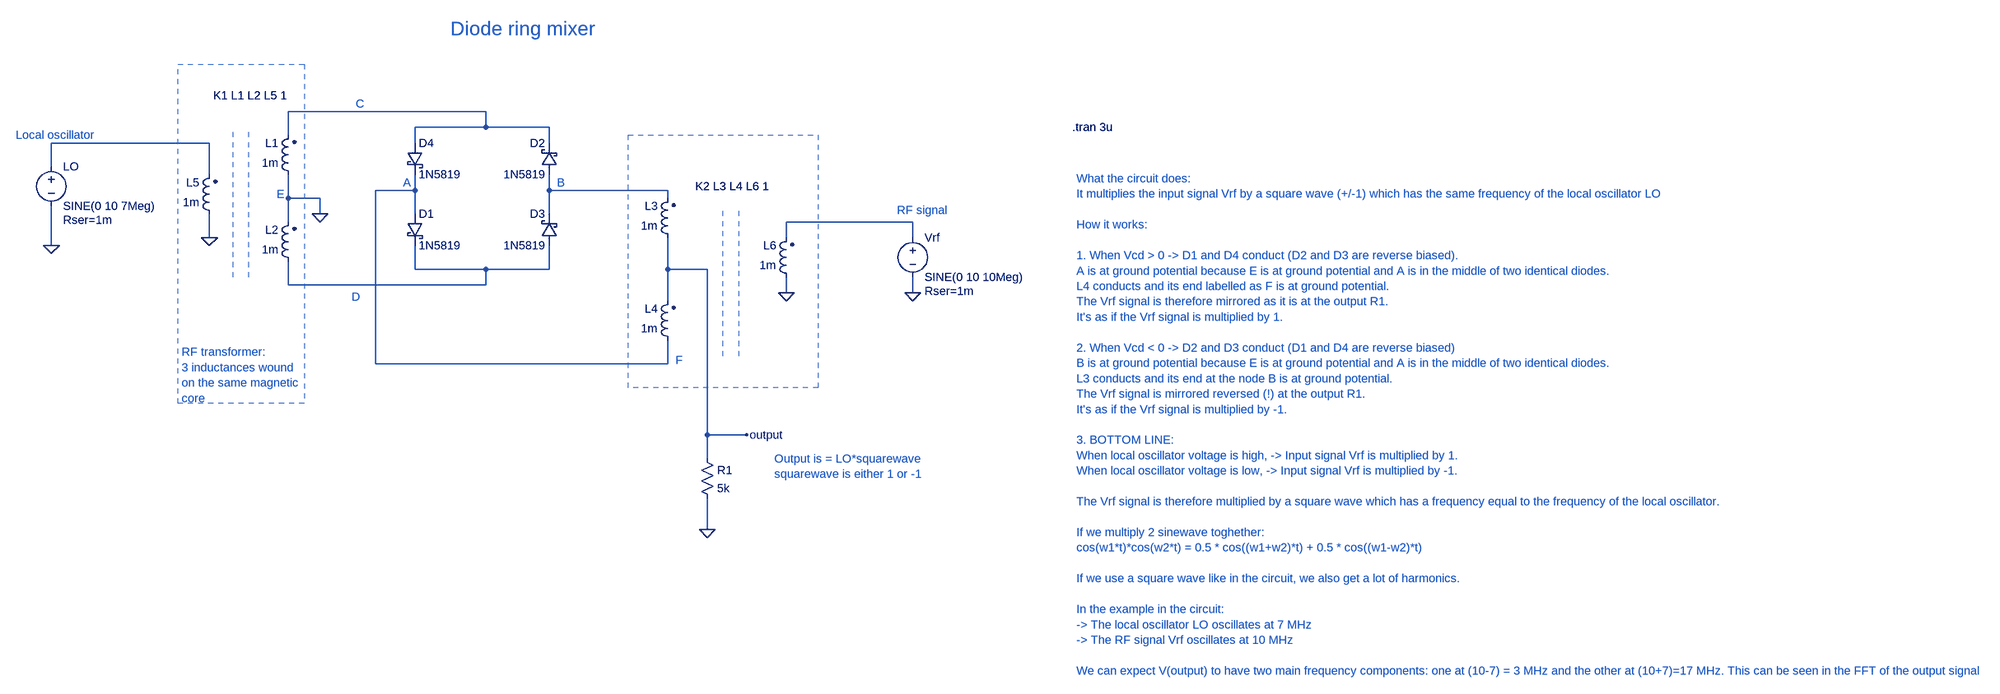
[diagram p0: schematic diode-ring-mixer.asc]
diode-ring-mixer.asc, the LTspice schematic file:
Version 4
SHEET 1 3404 1536
WIRE 272 0 -128 0
WIRE 272 32 272 0
WIRE 272 32 128 32
WIRE 400 32 272 32
WIRE -128 48 -128 0
WIRE -288 64 -608 64
WIRE 128 64 128 32
WIRE 400 64 400 32
WIRE -608 112 -608 64
WIRE -288 128 -288 64
WIRE 128 160 128 128
WIRE 128 160 48 160
WIRE 400 160 400 128
WIRE 640 160 400 160
WIRE -128 176 -128 128
WIRE -64 176 -128 176
WIRE 640 176 640 160
WIRE -64 208 -64 176
WIRE 128 208 128 160
WIRE 400 208 400 160
WIRE -128 224 -128 176
WIRE 1136 224 880 224
WIRE -288 256 -288 208
WIRE 880 256 880 224
WIRE 1136 256 1136 224
WIRE -608 272 -608 192
WIRE 128 320 128 272
WIRE 272 320 128 320
WIRE 400 320 400 272
WIRE 400 320 272 320
WIRE 640 320 640 256
WIRE 720 320 640 320
WIRE -128 352 -128 304
WIRE 272 352 272 320
WIRE 272 352 -128 352
WIRE 880 368 880 336
WIRE 1136 368 1136 336
WIRE 640 384 640 320
WIRE 48 512 48 160
WIRE 640 512 640 464
WIRE 640 512 48 512
WIRE 720 656 720 320
WIRE 800 656 720 656
WIRE 720 704 720 656
WIRE 720 848 720 784
FLAG 880 368 0
FLAG -64 208 0
FLAG -288 256 0
FLAG 1136 368 0
FLAG -608 272 0
FLAG 720 848 0
FLAG 800 656 output
SYMBOL ind2 -112 144 R180
WINDOW 0 36 80 Left 2
WINDOW 3 36 40 Left 2
SYMATTR InstName L1
SYMATTR Value 1m
SYMATTR Type ind
SYMBOL ind2 -112 320 R180
WINDOW 0 36 80 Left 2
WINDOW 3 36 40 Left 2
SYMATTR InstName L2
SYMATTR Value 1m
SYMATTR Type ind
SYMBOL ind2 656 272 R180
WINDOW 0 36 80 Left 2
WINDOW 3 36 40 Left 2
SYMATTR InstName L3
SYMATTR Value 1m
SYMATTR Type ind
SYMBOL ind2 656 480 R180
WINDOW 0 36 80 Left 2
WINDOW 3 36 40 Left 2
SYMATTR InstName L4
SYMATTR Value 1m
SYMATTR Type ind
SYMBOL ind2 -272 224 R180
WINDOW 0 36 80 Left 2
WINDOW 3 36 40 Left 2
SYMATTR InstName L5
SYMATTR Value 1m
SYMATTR Type ind
SYMBOL ind2 896 352 R180
WINDOW 0 36 80 Left 2
WINDOW 3 36 40 Left 2
SYMATTR InstName L6
SYMATTR Value 1m
SYMATTR Type ind
SYMBOL voltage -608 96 R0
WINDOW 123 0 0 Left 0
WINDOW 39 24 124 Left 2
SYMATTR SpiceLine Rser=1m
SYMATTR InstName LO
SYMATTR Value SINE(0 10 7Meg)
SYMBOL voltage 1136 240 R0
WINDOW 123 0 0 Left 0
WINDOW 39 24 124 Left 2
SYMATTR SpiceLine Rser=1m
SYMATTR InstName Vrf
SYMATTR Value SINE(0 10 10Meg)
SYMBOL res 704 688 R0
SYMATTR InstName R1
SYMATTR Value 5k
SYMBOL schottky 416 128 R180
WINDOW 0 24 64 Left 2
WINDOW 3 24 0 Left 2
SYMATTR InstName D2
SYMATTR Value 1N5819
SYMATTR Description Diode
SYMATTR Type diode
SYMBOL schottky 416 272 R180
WINDOW 0 24 64 Left 2
WINDOW 3 24 0 Left 2
SYMATTR InstName D3
SYMATTR Value 1N5819
SYMATTR Description Diode
SYMATTR Type diode
SYMBOL schottky 112 208 R0
SYMATTR InstName D1
SYMATTR Value 1N5819
SYMATTR Description Diode
SYMATTR Type diode
SYMBOL schottky 112 64 R0
SYMATTR InstName D4
SYMATTR Value 1N5819
SYMATTR Description Diode
SYMATTR Type diode
TEXT -280 -32 Left 2 !K1 L1 L2 L5 1
TEXT 696 152 Left 2 !K2 L3 L4 L6 1
TEXT 1496 32 Left 2 !.tran 3u
TEXT -680 48 Left 2 ;Local oscillator
TEXT 1104 200 Left 2 ;RF signal
TEXT 104 144 Left 2 ;A
TEXT 416 144 Left 2 ;B
TEXT 200 -168 Left 4 ;Diode ring mixer
TEXT 8 -16 Left 2 ;C
TEXT 0 376 Left 2 ;D
TEXT 1504 136 Left 2 ;What the circuit does:\nIt multiplies the input signal Vrf by a square wave (+/-1) which has the same frequency of the local oscillator LO\n \nHow it works:\n \n1. When Vcd > 0 -> D1 and D4 conduct (D2 and D3 are reverse biased).\nA is at ground potential because E is at ground potential and A is in the middle of two identical diodes.\nL4 conducts and its end labelled as F is at ground potential.\nThe Vrf signal is therefore mirrored as it is at the output R1.\nIt's as if the Vrf signal is multiplied by 1.\n \n2. When Vcd < 0 -> D2 and D3 conduct (D1 and D4 are reverse biased)\nB is at ground potential because E is at ground potential and A is in the middle of two identical diodes.\nL3 conducts and its end at the node B is at ground potential.\nThe Vrf signal is mirrored reversed (!) at the output R1.\nIt's as if the Vrf signal is multiplied by -1.\n \n3. BOTTOM LINE:\nWhen local oscillator voltage is high, -> Input signal Vrf is multiplied by 1.\nWhen local oscillator voltage is low, -> Input signal Vrf is multiplied by -1.\n \nThe Vrf signal is therefore multiplied by a square wave which has a frequency equal to the frequency of the local oscillator.\n \nIf we multiply 2 sinewave toghether:\ncos(w1*t)*cos(w2*t) = 0.5 * cos((w1+w2)*t) + 0.5 * cos((w1-w2)*t)\n \nIf we use a square wave like in the circuit, we also get a lot of harmonics.\n \nIn the example in the circuit:\n-> The local oscillator LO oscillates at 7 MHz\n-> The RF signal Vrf oscillates at 10 MHz\n \nWe can expect V(output) to have two main frequency components: one at (10-7) = 3 MHz and the other at (10+7)=17 MHz. This can be seen in the FFT of the output signal
TEXT -344 488 Left 2 ;RF transformer:\n3 inductances wound\non the same magnetic\ncore
TEXT -152 168 Left 2 ;E
TEXT 656 504 Left 2 ;F
TEXT 856 704 Left 2 ;Output is = LO*squarewave\nsquarewave is either 1 or -1
LINE Normal -240 336 -240 32 2
LINE Normal -208 336 -208 32 2
LINE Normal 752 496 752 192 2
LINE Normal 784 496 784 192 2
RECTANGLE Normal 944 560 560 48 2
RECTANGLE Normal -96 592 -352 -96 2

The netlist it stands for:
* diode-ring-mixer.asc
L1 0 N001 1m
L2 N006 0 1m
L3 output N004 1m
L4 N003 output 1m
L5 0 N002 1m
L6 0 N005 1m
V§LO N002 0 SINE(0 10 7Meg) Rser=1m
Vrf N005 0 SINE(0 10 10Meg) Rser=1m
R1 output 0 5k
D2 N004 N001 1N5819
D3 N006 N004 1N5819
D1 N003 N006 1N5819
D4 N001 N003 1N5819
.model D D
.lib standard.dio
K1 L1 L2 L5 1
K2 L3 L4 L6 1
.tran 3u
* Local oscillator
* RF signal
* A
* B
* Diode ring mixer
* C
* D
* What the circuit does:
* It multiplies the input signal Vrf by a square wave (+/-1) which has the same frequency of the local oscillator LO
* How it works:
* 1. When Vcd > 0 -> D1 and D4 conduct (D2 and D3 are reverse biased).
* A is at ground potential because E is at ground potential and A is in the middle of two identical diodes.
* L4 conducts and its end labelled as F is at ground potential.
* The Vrf signal is therefore mirrored as it is at the output R1.
* It's as if the Vrf signal is multiplied by 1.
* 2. When Vcd < 0 -> D2 and D3 conduct (D1 and D4 are reverse biased)
* B is at ground potential because E is at ground potential and A is in the middle of two identical diodes.
* L3 conducts and its end at the node B is at ground potential.
* The Vrf signal is mirrored reversed (!) at the output R1.
* It's as if the Vrf signal is multiplied by -1.
* 3. BOTTOM LINE:
* When local oscillator voltage is high, -> Input signal Vrf is multiplied by 1.
* When local oscillator voltage is low, -> Input signal Vrf is multiplied by -1.
* The Vrf signal is therefore multiplied by a square wave which has a frequency equal to the frequency of the local oscillator.
* If we multiply 2 sinewave toghether:
* cos(w1*t)*cos(w2*t) = 0.5 * cos((w1+w2)*t) + 0.5 * cos((w1-w2)*t)
* If we use a square wave like in the circuit, we also get a lot of harmonics.
* In the example in the circuit:
* -> The local oscillator LO oscillates at 7 MHz
* -> The RF signal Vrf oscillates at 10 MHz
* We can expect V(output) to have two main frequency components: one at (10-7) = 3 MHz and the other at (10+7)=17 MHz. This can be seen in the FFT of the output signal
* RF transformer:
* 3 inductances wound
* on the same magnetic
* core
* E
* F
* Output is = LO*squarewave
* squarewave is either 1 or -1
.backanno
.end